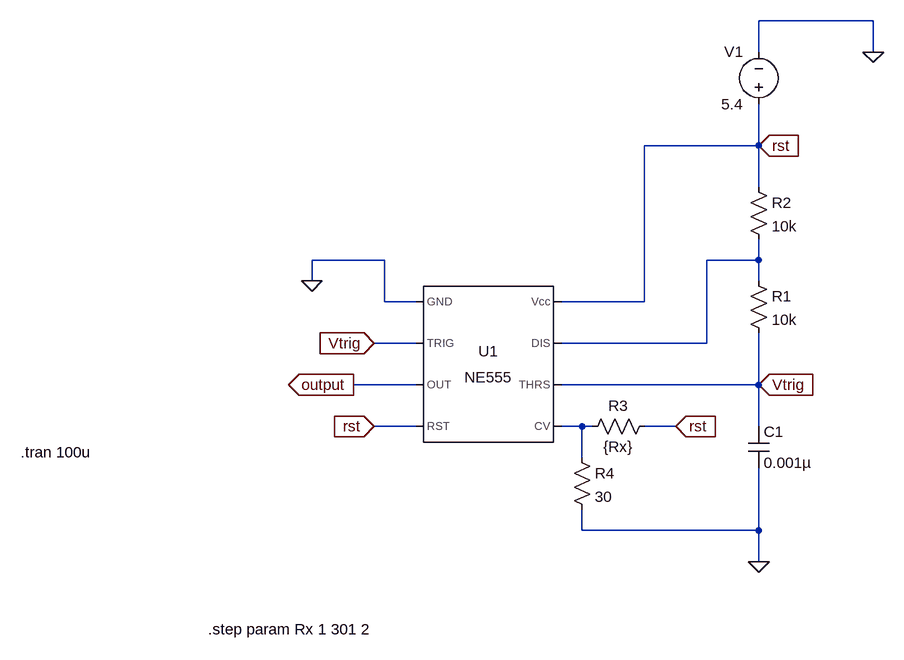
[diagram p0: schematic Draft1.asc]
Draft1.asc, the LTspice schematic file:
Version 4.1
SHEET 1 932 680
WIRE 752 -304 576 -304
WIRE 576 -256 576 -304
WIRE 752 -256 752 -304
WIRE 576 -112 576 -176
WIRE 576 -112 400 -112
WIRE 576 -48 576 -112
WIRE 0 64 -112 64
WIRE 576 64 576 32
WIRE 576 64 496 64
WIRE -112 96 -112 64
WIRE 576 96 576 64
WIRE 0 128 0 64
WIRE 48 128 0 128
WIRE 400 128 400 -112
WIRE 400 128 272 128
WIRE 48 192 -16 192
WIRE 496 192 496 64
WIRE 496 192 272 192
WIRE 48 256 -48 256
WIRE 576 256 576 176
WIRE 576 256 272 256
WIRE 48 320 -16 320
WIRE 304 320 272 320
WIRE 320 320 304 320
WIRE 448 320 400 320
WIRE 576 320 576 256
WIRE 304 368 304 320
WIRE 304 480 304 448
WIRE 576 480 576 384
WIRE 576 480 304 480
WIRE 576 528 576 480
FLAG -112 96 0
FLAG -16 192 Vtrig
IOPIN -16 192 In
FLAG 576 256 Vtrig
IOPIN 576 256 In
FLAG -16 320 rst
IOPIN -16 320 In
FLAG 576 -112 rst
IOPIN 576 -112 In
FLAG 752 -256 0
FLAG -48 256 output
IOPIN -48 256 Out
FLAG 576 528 0
FLAG 448 320 rst
IOPIN 448 320 In
SYMBOL Misc\\NE555 160 224 R0
SYMATTR InstName U1
SYMBOL res 560 80 R0
SYMATTR InstName R1
SYMATTR Value 10k
SYMBOL res 560 -64 R0
SYMATTR InstName R2
SYMATTR Value 10k
SYMBOL voltage 576 -160 R180
WINDOW 0 24 96 Left 2
WINDOW 3 24 16 Left 2
WINDOW 123 0 0 Left 0
WINDOW 39 0 0 Left 0
SYMATTR InstName V1
SYMATTR Value 5.4
SYMBOL cap 560 320 R0
SYMATTR InstName C1
SYMATTR Value 0.001µ
SYMBOL res 416 304 R90
WINDOW 0 0 56 VBottom 2
WINDOW 3 32 56 VTop 2
SYMATTR InstName R3
SYMATTR Value {Rx}
SYMBOL res 288 352 R0
SYMATTR InstName R4
SYMATTR Value 30
TEXT -560 360 Left 2 !.tran 100u
TEXT -272 632 Left 2 !.step param Rx 1 301 2

The netlist it stands for:
* Draft1.asc
X§U1 0 Vtrig output rst N002 Vtrig N001 rst NE555  ; pins GND TRIG OUT RST CV THRS DIS Vcc
R1 N001 Vtrig 10k
R2 rst N001 10k
V1 rst 0 5.4
C1 Vtrig 0 0.001µ
R3 rst N002 {Rx}
R4 N002 0 30
.tran 100u
.step param Rx 1 301 2
.lib NE555.sub
.backanno
.end